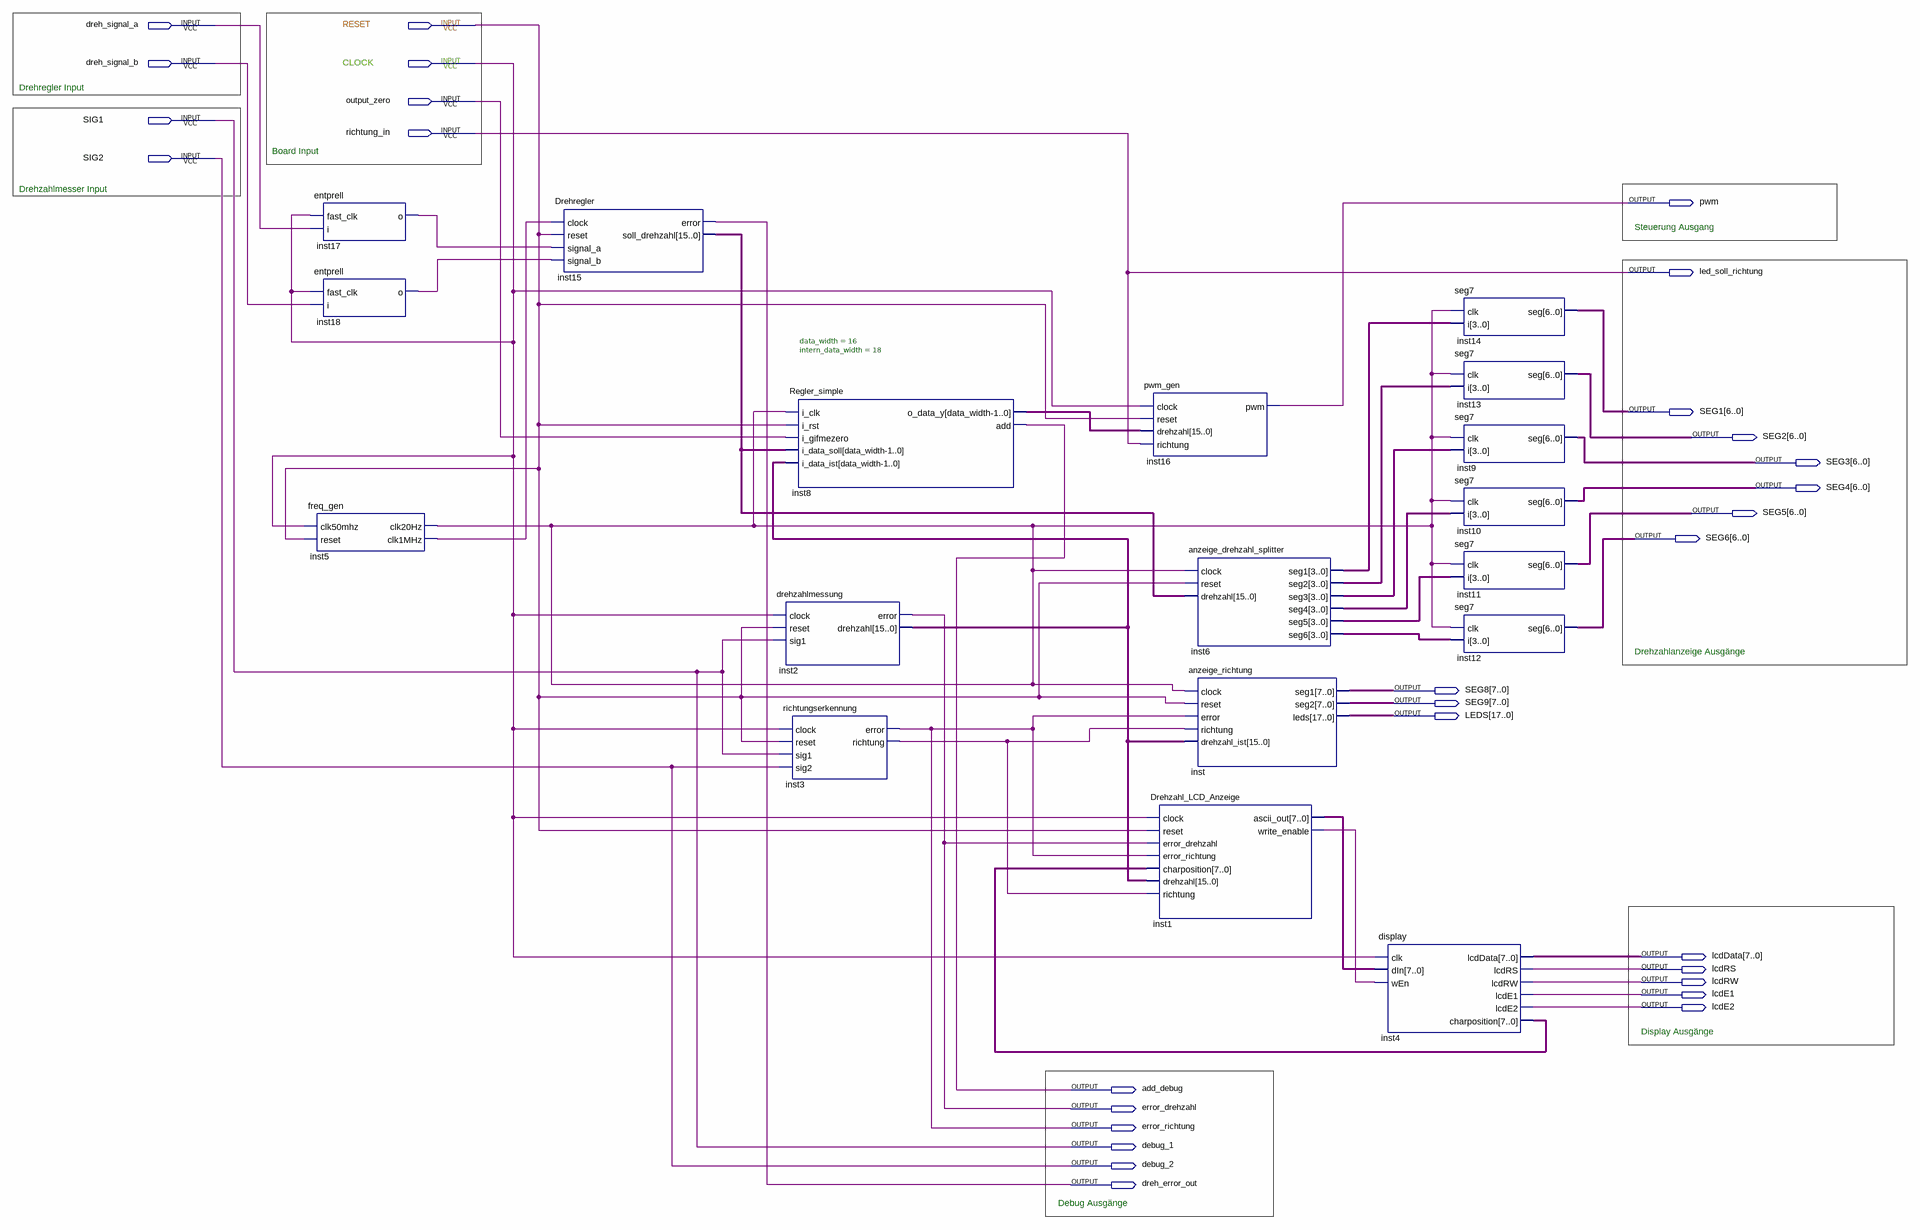
[diagram p0: schematic sheet]
// Quartus schematic Konzept.bdf as structural Verilog: 18 symbols, 30 pins
module Konzept (
  input  dreh_signal_a,
  input  RESET,
  input  dreh_signal_b,
  input  CLOCK,
  input  output_zero,
  input  SIG1,
  input  richtung_in,
  input  SIG2,
  output pwm,
  output led_soll_richtung,
  output [6:0] SEG1,
  output [6:0] SEG2,
  output [6:0] SEG3,
  output [6:0] SEG4,
  output [6:0] SEG5,
  output [6:0] SEG6,
  output [7:0] SEG8,
  output [7:0] SEG9,
  output [17:0] LEDS,
  output [7:0] lcdData,
  output lcdRS,
  output lcdRW,
  output lcdE1,
  output lcdE2,
  output add_debug,
  output error_drehzahl,
  output error_richtung,
  output debug_1,
  output debug_2,
  output dreh_error_out
);

  wire inst1_write_enable, inst3_richtung, inst5_clk1mhz, inst5_clk20hz, inst17_o, inst18_o;
  wire [3:0] inst6_seg1, inst6_seg2, inst6_seg3, inst6_seg4, inst6_seg5, inst6_seg6;
  wire [7:0] inst1_ascii_out, inst4_charposition;
  wire [15:0] inst2_drehzahl, inst8_o_data_y, inst15_soll_drehzahl;

  entprell inst17 (.fast_clk(CLOCK), .i(dreh_signal_a), .o(inst17_o));
  entprell inst18 (.fast_clk(CLOCK), .i(dreh_signal_b), .o(inst18_o));
  freq_gen inst5 (.clk50mhz(CLOCK), .reset(RESET), .clk20Hz(inst5_clk20hz), .clk1MHz(inst5_clk1mhz));
  Drehregler inst15 (
    .clock(inst5_clk1mhz), .reset(RESET), .signal_a(inst17_o), .signal_b(inst18_o), .error(dreh_error_out),
    .soll_drehzahl(inst15_soll_drehzahl));
  Regler_simple #(.data_width(16), .intern_data_width(18)) inst8 (
    .i_clk(inst5_clk20hz), .i_rst(RESET), .i_gifmezero(output_zero), .i_data_soll(inst15_soll_drehzahl),
    .i_data_ist(inst2_drehzahl), .o_data_y(inst8_o_data_y), .add(add_debug));
  drehzahlmessung inst2 (.clock(CLOCK), .reset(RESET), .sig1(SIG1), .error(error_drehzahl), .drehzahl(inst2_drehzahl));
  richtungserkennung inst3 (
    .clock(CLOCK), .reset(RESET), .sig1(SIG1), .sig2(SIG2), .error(error_richtung), .richtung(inst3_richtung));
  pwm_gen inst16 (.clock(CLOCK), .reset(RESET), .drehzahl(inst8_o_data_y), .richtung(richtung_in), .pwm(pwm));
  Drehzahl_LCD_Anzeige inst1 (
    .clock(CLOCK), .reset(RESET), .error_drehzahl(error_drehzahl), .error_richtung(error_richtung),
    .charposition(inst4_charposition), .drehzahl(inst2_drehzahl), .richtung(inst3_richtung),
    .ascii_out(inst1_ascii_out), .write_enable(inst1_write_enable));
  anzeige_drehzahl_splitter inst6 (
    .clock(inst5_clk20hz), .reset(RESET), .drehzahl(inst15_soll_drehzahl), .seg1(inst6_seg1),
    .seg2(inst6_seg2), .seg3(inst6_seg3), .seg4(inst6_seg4), .seg5(inst6_seg5), .seg6(inst6_seg6));
  anzeige_richtung inst (
    .clock(inst5_clk20hz), .reset(RESET), .error(error_richtung), .richtung(inst3_richtung),
    .drehzahl_ist(inst2_drehzahl), .seg1(SEG8), .seg2(SEG9), .leds(LEDS));
  display inst4 (
    .clk(CLOCK), .dIn(inst1_ascii_out), .wEn(inst1_write_enable), .lcdData(lcdData), .lcdRS(lcdRS),
    .lcdRW(lcdRW), .lcdE1(lcdE1), .lcdE2(lcdE2), .charposition(inst4_charposition));
  seg7 inst14 (.clk(inst5_clk20hz), .i(inst6_seg1), .seg(SEG1));
  seg7 inst13 (.clk(inst5_clk20hz), .i(inst6_seg2), .seg(SEG2));
  seg7 inst9 (.clk(inst5_clk20hz), .i(inst6_seg3), .seg(SEG3));
  seg7 inst10 (.clk(inst5_clk20hz), .i(inst6_seg4), .seg(SEG4));
  seg7 inst11 (.clk(inst5_clk20hz), .i(inst6_seg5), .seg(SEG5));
  seg7 inst12 (.clk(inst5_clk20hz), .i(inst6_seg6), .seg(SEG6));

  assign debug_1 = SIG1;
  assign debug_2 = SIG2;
  assign led_soll_richtung = richtung_in;

  // Notes on the sheet:
  //   Drehregler Input
  //   Board Input
  //   Drehzahlmesser Input
  //   Steuerung Ausgang
  //   Drehzahlanzeige Ausgänge
  //   Display Ausgänge
  //   Debug Ausgänge
endmodule
